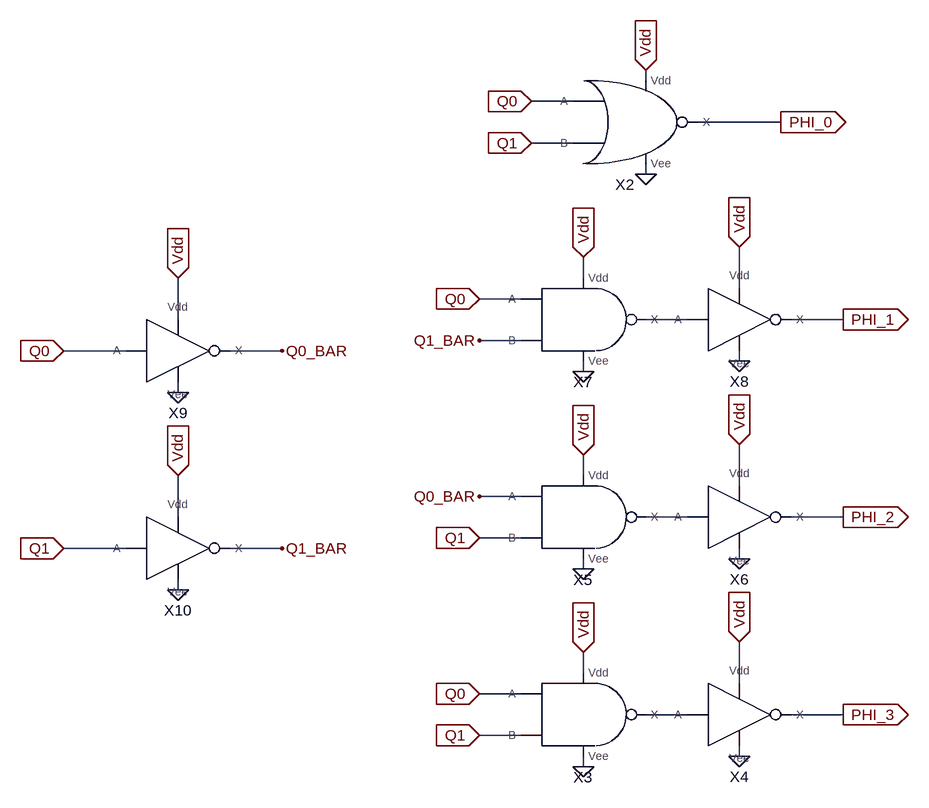
[diagram p0: schematic DECODER.asc]
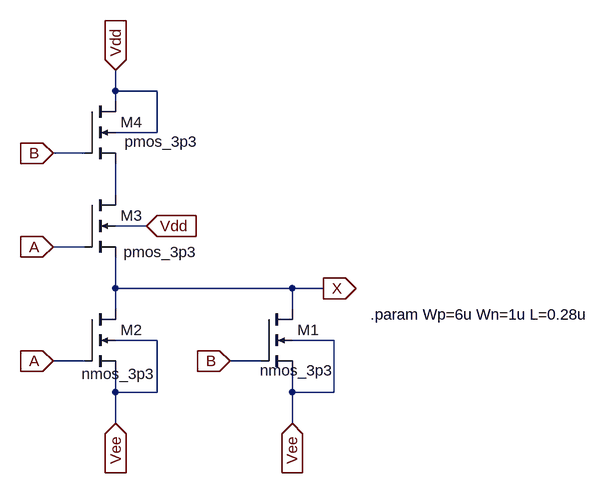
[diagram p1: sub-circuit nor2x1.asc]
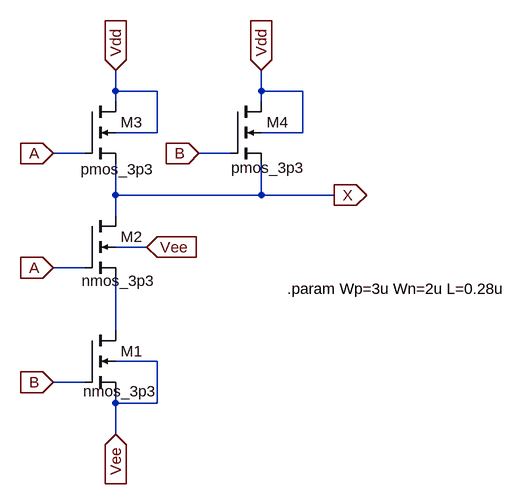
[diagram p2: sub-circuit nand2x1.asc]
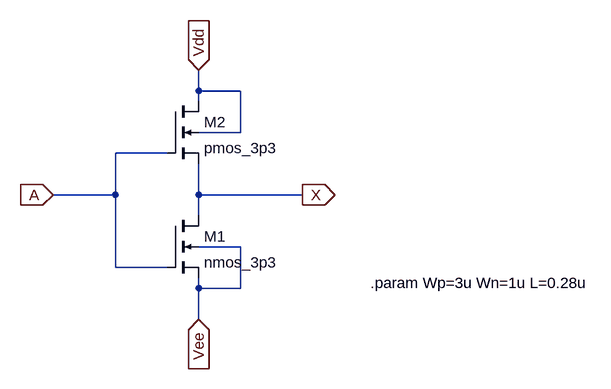
[diagram p3: sub-circuit invx1.asc]
DECODER.asc, the LTspice schematic file:
Version 4
SHEET 1 1556 832
WIRE 832 -304 832 -320
WIRE 720 -272 656 -272
WIRE 1040 -240 912 -240
WIRE 720 -208 656 -208
WIRE 832 -160 832 -176
WIRE 736 0 736 -32
WIRE 976 16 976 -48
WIRE 640 32 576 32
WIRE 112 64 112 0
WIRE 896 64 832 64
WIRE 1136 64 1056 64
WIRE 640 96 576 96
WIRE 32 112 -64 112
WIRE 272 112 192 112
WIRE 976 128 976 112
WIRE 736 144 736 128
WIRE 112 176 112 160
WIRE 736 304 736 272
WIRE 976 320 976 256
WIRE 640 336 576 336
WIRE 112 368 112 304
WIRE 896 368 832 368
WIRE 1136 368 1056 368
WIRE 640 400 576 400
WIRE 32 416 -64 416
WIRE 272 416 192 416
WIRE 976 432 976 416
WIRE 736 448 736 432
WIRE 112 480 112 464
WIRE 736 608 736 576
WIRE 976 624 976 560
WIRE 640 640 576 640
WIRE 896 672 832 672
WIRE 1136 672 1056 672
WIRE 640 704 576 704
WIRE 976 736 976 720
WIRE 736 752 736 736
FLAG 1136 64 PHI_1
IOPIN 1136 64 Out
FLAG 832 -160 0
FLAG 1040 -240 PHI_0
IOPIN 1040 -240 Out
FLAG 976 736 0
FLAG 736 752 0
FLAG 1136 672 PHI_3
IOPIN 1136 672 Out
FLAG 976 432 0
FLAG 736 448 0
FLAG 576 96 Q1_BAR
FLAG 1136 368 PHI_2
IOPIN 1136 368 Out
FLAG 976 128 0
FLAG 736 144 0
FLAG 112 176 0
FLAG -64 112 Q0
IOPIN -64 112 In
FLAG 272 112 Q0_BAR
FLAG 112 480 0
FLAG -64 416 Q1
IOPIN -64 416 In
FLAG 272 416 Q1_BAR
FLAG 576 336 Q0_BAR
FLAG 656 -272 Q0
IOPIN 656 -272 In
FLAG 656 -208 Q1
IOPIN 656 -208 In
FLAG 576 32 Q0
IOPIN 576 32 In
FLAG 576 400 Q1
IOPIN 576 400 In
FLAG 576 640 Q0
IOPIN 576 640 In
FLAG 576 704 Q1
IOPIN 576 704 In
FLAG 112 0 Vdd
IOPIN 112 0 In
FLAG 112 304 Vdd
IOPIN 112 304 In
FLAG 832 -320 Vdd
IOPIN 832 -320 In
FLAG 736 -32 Vdd
IOPIN 736 -32 In
FLAG 976 -48 Vdd
IOPIN 976 -48 In
FLAG 736 272 Vdd
IOPIN 736 272 In
FLAG 976 256 Vdd
IOPIN 976 256 In
FLAG 736 576 Vdd
IOPIN 736 576 In
FLAG 976 560 Vdd
IOPIN 976 560 In
SYMBOL NOR2x1 800 -240 R0
SYMATTR InstName X2
SYMBOL NAND2x1 736 672 R0
SYMATTR InstName X3
SYMBOL INVx1 976 672 R0
SYMATTR InstName X4
SYMBOL NAND2x1 736 368 R0
SYMATTR InstName X5
SYMBOL INVx1 976 368 R0
SYMATTR InstName X6
SYMBOL NAND2x1 736 64 R0
SYMATTR InstName X7
SYMBOL INVx1 976 64 R0
SYMATTR InstName X8
SYMBOL INVx1 112 112 R0
SYMATTR InstName X9
SYMBOL INVx1 112 416 R0
SYMATTR InstName X10

nor2x1.asc, the sub-circuit schematic file:
Version 4.1
SHEET 1 2956 680
WIRE 1680 -496 1680 -528
WIRE 1744 -496 1680 -496
WIRE 1680 -480 1680 -496
WIRE 1744 -432 1744 -496
WIRE 1744 -432 1680 -432
WIRE 1632 -400 1584 -400
WIRE 1680 -336 1680 -384
WIRE 1728 -288 1680 -288
WIRE 1632 -256 1584 -256
WIRE 1680 -192 1680 -240
WIRE 1952 -192 1680 -192
WIRE 2000 -192 1952 -192
WIRE 1680 -160 1680 -192
WIRE 1952 -160 1952 -192
WIRE 1744 -112 1680 -112
WIRE 2016 -112 1952 -112
WIRE 1632 -80 1584 -80
WIRE 1904 -80 1856 -80
WIRE 1680 -32 1680 -64
WIRE 1744 -32 1744 -112
WIRE 1744 -32 1680 -32
WIRE 1952 -32 1952 -64
WIRE 2016 -32 2016 -112
WIRE 2016 -32 1952 -32
WIRE 1680 16 1680 -32
WIRE 1952 16 1952 -32
FLAG 1584 -256 A
IOPIN 1584 -256 In
FLAG 2000 -192 X
IOPIN 2000 -192 Out
FLAG 1680 -528 Vdd
IOPIN 1680 -528 In
FLAG 1584 -80 A
IOPIN 1584 -80 In
FLAG 1856 -80 B
IOPIN 1856 -80 In
FLAG 1584 -400 B
IOPIN 1584 -400 In
FLAG 1952 16 Vee
IOPIN 1952 16 In
FLAG 1680 16 Vee
IOPIN 1680 16 In
FLAG 1728 -288 Vdd
IOPIN 1728 -288 In
SYMBOL nmos4 1904 -160 R0
WINDOW 3 -2 94 Left 2
SYMATTR Value nmos_3p3
SYMATTR InstName M1
SYMATTR Value2 l={L} w={Wn}
SYMBOL nmos4 1632 -336 R0
WINDOW 3 60 88 Left 2
SYMATTR Value pmos_3p3
SYMATTR InstName M3
SYMATTR Value2 l={L} w={Wp}
SYMBOL nmos4 1632 -480 R0
WINDOW 3 62 62 Left 2
SYMATTR Value pmos_3p3
SYMATTR InstName M4
SYMATTR Value2 l={L} w={Wp}
SYMBOL nmos4 1632 -160 R0
WINDOW 3 -4 100 Left 2
SYMATTR Value nmos_3p3
SYMATTR InstName M2
SYMATTR Value2 l={L} w={Wn}
TEXT 2072 -152 Left 2 !.param Wp=6u Wn=1u L=0.28u

nand2x1.asc, the sub-circuit schematic file:
Version 4.1
SHEET 1 900 680
WIRE -96 32 -96 0
WIRE -32 32 -96 32
WIRE 128 32 128 0
WIRE 192 32 128 32
WIRE -96 48 -96 32
WIRE 128 48 128 32
WIRE -32 96 -32 32
WIRE -32 96 -96 96
WIRE 192 96 192 32
WIRE 192 96 128 96
WIRE -144 128 -192 128
WIRE 80 128 32 128
WIRE -96 192 -96 144
WIRE 128 192 128 144
WIRE 128 192 -96 192
WIRE 240 192 128 192
WIRE -96 224 -96 192
WIRE -48 272 -96 272
WIRE -144 304 -192 304
WIRE -96 400 -96 320
WIRE -32 448 -96 448
WIRE -144 480 -192 480
WIRE -96 512 -96 496
WIRE -32 512 -32 448
WIRE -32 512 -96 512
WIRE -96 560 -96 512
FLAG -96 0 Vdd
IOPIN -96 0 In
FLAG -192 128 A
IOPIN -192 128 In
FLAG 240 192 X
IOPIN 240 192 Out
FLAG 128 0 Vdd
IOPIN 128 0 In
FLAG -192 304 A
IOPIN -192 304 In
FLAG -192 480 B
IOPIN -192 480 In
FLAG 32 128 B
IOPIN 32 128 In
FLAG -96 560 Vee
IOPIN -96 560 In
FLAG -48 272 Vee
IOPIN -48 272 In
SYMBOL nmos4 -144 400 R0
WINDOW 3 -2 94 Left 2
SYMATTR Value nmos_3p3
SYMATTR InstName M1
SYMATTR Value2 l={L} w={Wn}
SYMBOL nmos4 -144 48 R0
WINDOW 3 -6 104 Left 2
SYMATTR Value pmos_3p3
SYMATTR InstName M3
SYMATTR Value2 l={L} w={Wp}
SYMBOL nmos4 80 48 R0
WINDOW 3 2 102 Left 2
SYMATTR Value pmos_3p3
SYMATTR InstName M4
SYMATTR Value2 l={L} w={Wp}
SYMBOL nmos4 -144 224 R0
WINDOW 3 -4 100 Left 2
SYMATTR Value nmos_3p3
SYMATTR InstName M2
SYMATTR Value2 l={L} w={Wn}
TEXT 168 336 Left 2 !.param Wp=3u Wn=2u L=0.28u

invx1.asc, the sub-circuit schematic file:
Version 4
SHEET 1 2776 836
WIRE 416 -16 416 -48
WIRE 480 -16 416 -16
WIRE 416 0 416 -16
WIRE 480 48 480 -16
WIRE 480 48 416 48
WIRE 368 80 288 80
WIRE 288 144 288 80
WIRE 288 144 192 144
WIRE 416 144 416 96
WIRE 576 144 416 144
WIRE 416 176 416 144
WIRE 480 224 416 224
WIRE 288 256 288 144
WIRE 368 256 288 256
WIRE 416 288 416 272
WIRE 480 288 480 224
WIRE 480 288 416 288
WIRE 416 336 416 288
FLAG 416 -48 Vdd
IOPIN 416 -48 In
FLAG 192 144 A
IOPIN 192 144 In
FLAG 576 144 X
IOPIN 576 144 Out
FLAG 416 336 Vee
IOPIN 416 336 In
SYMBOL nmos4 368 176 R0
SYMATTR InstName M1
SYMATTR Value nmos_3p3
SYMATTR Value2 l={L} w={Wn}
SYMBOL nmos4 368 0 R0
SYMATTR InstName M2
SYMATTR Value pmos_3p3
SYMATTR Value2 l={L} w={Wp}
TEXT 680 280 Left 2 !.param Wp=3u Wn=1u L=0.28u

The netlist it stands for:
* DECODER.asc
XX2 Q0 Q1 Vdd 0 PHI_0 nor2x1
XX3 Q0 Q1 Vdd N003 0 nand2x1
XX4 N003 Vdd PHI_3 0 invx1
XX5 Q0_BAR Q1 Vdd N002 0 nand2x1
XX6 N002 Vdd PHI_2 0 invx1
XX7 Q0 Q1_BAR Vdd N001 0 nand2x1
XX8 N001 Vdd PHI_1 0 invx1
XX9 Q0 Vdd Q0_BAR 0 invx1
XX10 Q1 Vdd Q1_BAR 0 invx1

* block symbol definitions
.subckt nor2x1 A B Vdd Vee X
M1 X B Vee Vee nmos_3p3 l={L} w={Wn}
M3 N001 A X Vdd pmos_3p3 l={L} w={Wp}
M4 Vdd B N001 Vdd pmos_3p3 l={L} w={Wp}
M2 X A Vee Vee nmos_3p3 l={L} w={Wn}
.param Wp=6u Wn=1u L=0.28u
.ends nor2x1

.subckt nand2x1 A B Vdd X Vee
M1 N001 B Vee Vee nmos_3p3 l={L} w={Wn}
M3 Vdd A X Vdd pmos_3p3 l={L} w={Wp}
M4 Vdd B X Vdd pmos_3p3 l={L} w={Wp}
M2 X A N001 Vee nmos_3p3 l={L} w={Wn}
.param Wp=3u Wn=2u L=0.28u
.ends nand2x1

.subckt invx1 A Vdd X Vee
M1 X A Vee Vee nmos_3p3 l={L} w={Wn}
M2 Vdd A X Vdd pmos_3p3 l={L} w={Wp}
.param Wp=3u Wn=1u L=0.28u
.ends invx1

.model NMOS NMOS
.model PMOS PMOS
.lib standard.mos
.backanno
.end